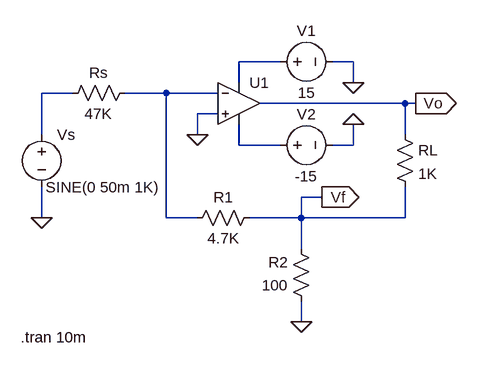
[diagram p0: schematic Run 4_A.asc]
Run 4_A.asc, the LTspice schematic file:
Version 4
SHEET 1 1288 680
WIRE 992 128 928 128
WIRE 1104 128 1072 128
WIRE 928 160 928 128
WIRE 1104 160 1104 128
WIRE 672 176 624 176
WIRE 816 176 752 176
WIRE 896 176 816 176
WIRE 1184 192 960 192
WIRE 1200 192 1184 192
WIRE 896 208 864 208
WIRE 624 240 624 176
WIRE 864 240 864 208
WIRE 1184 240 1184 192
WIRE 928 256 928 224
WIRE 992 256 928 256
WIRE 1104 256 1104 224
WIRE 1104 256 1072 256
WIRE 1056 336 1024 336
WIRE 624 368 624 320
WIRE 816 368 816 176
WIRE 864 368 816 368
WIRE 1024 368 1024 336
WIRE 1024 368 944 368
WIRE 1184 368 1184 320
WIRE 1184 368 1024 368
WIRE 1024 416 1024 368
WIRE 1024 528 1024 496
FLAG 1104 160 0
FLAG 1104 224 0
FLAG 864 240 0
FLAG 1200 192 Vo
IOPIN 1200 192 Out
FLAG 1024 528 0
FLAG 624 368 0
FLAG 1056 336 Vf
IOPIN 1056 336 Out
SYMBOL OpAmps\\UniversalOpamp2 928 192 R0
SYMATTR InstName U1
SYMBOL voltage 976 128 R270
WINDOW 0 32 56 VTop 2
WINDOW 3 -32 56 VBottom 2
WINDOW 123 0 0 Left 0
WINDOW 39 0 0 Left 0
SYMATTR InstName V1
SYMATTR Value 15
SYMBOL voltage 976 256 R270
WINDOW 0 32 56 VTop 2
WINDOW 3 -32 56 VBottom 2
WINDOW 123 0 0 Left 0
WINDOW 39 0 0 Left 0
SYMATTR InstName V2
SYMATTR Value -15
SYMBOL res 960 352 R90
WINDOW 0 0 56 VBottom 2
WINDOW 3 32 56 VTop 2
SYMATTR InstName R1
SYMATTR Value 4.7K
SYMBOL res 1040 512 R180
WINDOW 0 36 76 Left 2
WINDOW 3 36 40 Left 2
SYMATTR InstName R2
SYMATTR Value 100
SYMBOL res 1168 224 R0
SYMATTR InstName RL
SYMATTR Value 1K
SYMBOL voltage 624 224 R0
WINDOW 3 6 97 Left 2
WINDOW 123 0 0 Left 0
WINDOW 39 0 0 Left 0
SYMATTR Value SINE(0 50m 1K)
SYMATTR InstName Vs
SYMBOL res 768 160 R90
WINDOW 0 0 56 VBottom 2
WINDOW 3 32 56 VTop 2
SYMATTR InstName Rs
SYMATTR Value 47K
TEXT 592 552 Left 2 !.tran 10m

The netlist it stands for:
* Run 4_A.asc
XU1 0 N003 N001 N004 Vo level.2 Avol=1Meg GBW=10Meg Slew=10Meg ilimit=25m rail=0 Vos=0 phimargin=45 en=0 enk=0 in=0 ink=0 Rin=500Meg  ; pins IN+ IN- V+ V- OUT
V1 N001 0 15
V2 N004 0 -15
R1 Vf N003 4.7K
R2 0 Vf 100
RL Vo Vf 1K
Vs N002 0 SINE(0 50m 1K)
Rs N003 N002 47K
.tran 10m
.lib UniversalOpamps2.sub
.backanno
.end